# Altium project tourelles.PrjPcb
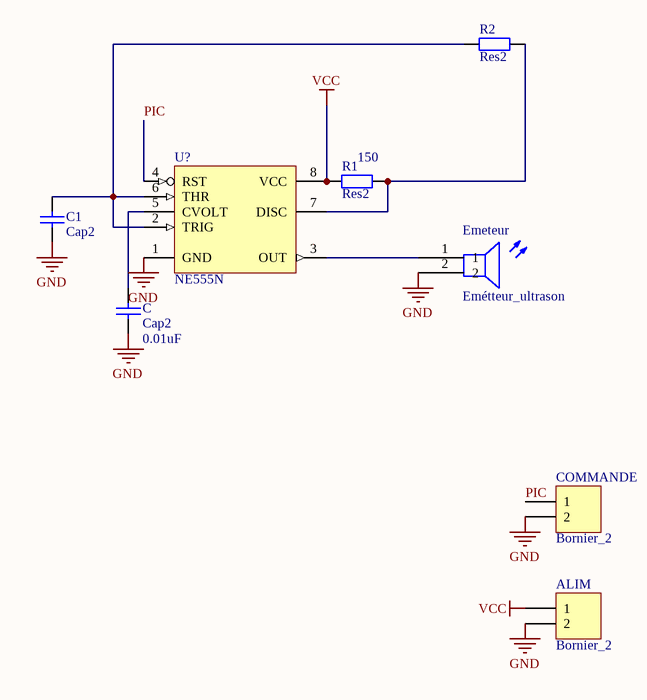
[diagram p0: tourellesEmetteurs.SchDoc]
2 sheets, 17 parts. Net scope: global (net labels, ports and power ports of the same name join across sheets).
Sheets:
  tourellesEmetteurs.SchDoc
  tourellesCommande.SchDoc

## Sheet tourellesEmetteurs.SchDoc: Tourelle
size A4

### Parts
(Parts that share a designator on the sheet are numbered #1, #2 ... from top to bottom, then left to right.)
ALIM#1  Bornier_2  [Bornier_2]
C  Cap2  value 0.01uF  [CAPA2]
C1#1  Cap2  [CAPA2]
COMMANDE  Bornier_2  [Bornier_2]
Emeteur  Emétteur_ultrason  [TX/RX_ultrason]
R1#1  Res2  value 150  [res5_1/4W]
R2  Res2  [res5_1/4W]
U?#1  NE555N  [DIP8]

### Nets
GND: ALIM#1.2 C.1 C1#1.1 COMMANDE.2 Emeteur.2 U?#1.1(GND)
VCC: ALIM#1.1 R1#1.2 U?#1.8(VCC)
PIC: COMMANDE.1 U?#1.4(RST)
NetC1#1_2: C1#1.2 R2.1 U?#1.2(TRIG) U?#1.6(THR)
NetC_2: C.2 U?#1.5(CVOLT)
NetEmeteur_1: Emeteur.1 U?#1.3(OUT)
NetR1#1_1: R1#1.1 R2.2 U?#1.7(DISC)

### Notes on the sheet
- Title :
- Size:
- A4
- Date:
- Time:
- File:

### Library data of the parts
ALIM#1 COMMANDE = Bornier_2: Header, 2-Pin; LatestRevisionDate: 17-Jul-2002; LatestRevisionNote: Re-released for DXP Platform.; Publisher: Altium Limited
C C1#1 = Cap2: Capacitor; Published: 8-Jun-2000; LatestRevisionDate: 17-Jul-2002; LatestRevisionNote: Re-released for DXP Platform.; PackageReference: RAD-0.3; Publisher: Altium Limited
Emeteur = Emétteur_ultrason: RX_ultrason; Published: 24-Mar-1999; LatestRevisionDate: 17-Jul-2002; LatestRevisionNote: Re-released for DXP Platform.; PackageReference: PIN2; Publisher: Altium Limited
R1#1 = Res2: Resistor; Published: 8-Jun-2000; LatestRevisionDate: 17-Jul-2002; LatestRevisionNote: Re-released for DXP Platform.; PackageReference: AXIAL-0.4; Publisher: Altium Limited
R2 = Res2: Resistor; Value: 1K; Published: 8-Jun-2000; LatestRevisionDate: 17-Jul-2002; LatestRevisionNote: Re-released for DXP Platform.; PackageReference: AXIAL-0.4; Publisher: Altium Limited
U?#1 = NE555N: General-Purpose Single Bipolar Timer; Published: 24-Aug-2001; LatestRevisionDate: 06-Jun-2005; LatestRevisionNote: Stylized 3D Model Added.; DatasheetVersion: Jul-1998; PackageReference: DIP8; Publisher: Altium Limited; PackageDescription: DIP; 8 Leads; Row Spacing 7.62 mm; Pitch 2.54 mm; Code_JEDEC: MO-001-AN; ComponentLink1Description: Manufacturer Link; ComponentLink1URL: http://www.st.com/; ComponentLink2Description: Datasheet; ComponentLink2URL: http://www.st.com/stonline/products/literature/ds/2182/ne555.pdf

## Sheet tourellesCommande.SchDoc: Commande
size A4
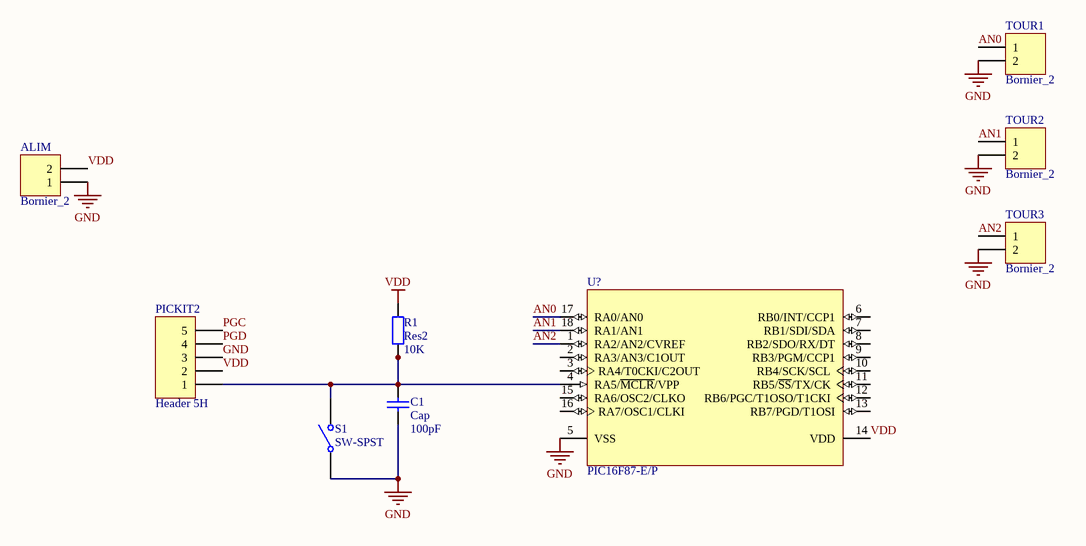
[diagram p1: tourellesCommande.SchDoc]

### Parts
(Parts that share a designator on the sheet are numbered #1, #2 ... from top to bottom, then left to right.)
ALIM#2  Bornier_2  [Bornier_2]
C1#2  Cap  value 100pF  [RAD-0.3]
PICKIT2  Header 5H  [HDR1X5]
R1#2  Res2  value 10K  [AXIAL-0.4]
S1  SW-SPST  [SPST-2]
TOUR1  Bornier_2  [Bornier_2]
TOUR2  Bornier_2  [Bornier_2]
TOUR3  Bornier_2  [Bornier_2]
U?#2  PIC16F87-E/P  [PDIP300-18]

### Nets
GND: ALIM#2.1 C1#2.1 PICKIT2.3 S1.1(COMMON) TOUR1.2 TOUR2.2 TOUR3.2 U?#2.5(VSS)
VDD: ALIM#2.2 PICKIT2.2 R1#2.2 U?#2.14(VDD)
AN0: TOUR1.1 U?#2.17(RA0/AN0)
AN1: TOUR2.1 U?#2.18(RA1/AN1)
AN2: TOUR3.1 U?#2.1(RA2/AN2/CVREF)
PGC: PICKIT2.5
PGD: PICKIT2.4
NetC1#2_2: C1#2.2 PICKIT2.1 R1#2.1 S1.2(NO) U?#2.4(RA5/~{MCLR}/VPP)

Not connected (* = marked no-connect by the designer): U?#2 2(RA3/AN3/C1OUT) 3(RA4/T0CKI/C2OUT) 6(RB0/INT/CCP1) 7(RB1/SDI/SDA) 8(RB2/SDO/RX/DT) 9(RB3/PGM/CCP1) 10(RB4/SCK/SCL) 11(RB5/~{SS}/TX/CK) 12(RB6/PGC/T1OSO/T1CKI) 13(RB7/PGD/T1OSI) 15(RA6/OSC2/CLKO) 16(RA7/OSC1/CLKI)

### Notes on the sheet
- Title :
- Size:
- A4
- Date:
- Time:
- File:

### Library data of the parts
ALIM#2 TOUR1-TOUR3 = Bornier_2: Header, 2-Pin; LatestRevisionDate: 17-Jul-2002; LatestRevisionNote: Re-released for DXP Platform.; Publisher: Altium Limited
C1#2 = Cap: Capacitor; Published: 8-Jun-2000; LatestRevisionDate: 17-Jul-2002; LatestRevisionNote: Re-released for DXP Platform.; PackageReference: RAD-0.3; Publisher: Altium Limited; PackageDescription: Radial Cap, Thru-Hole; 2 Leads; 0.3 in Pin Spacing
PICKIT2 = Header 5H: Header, 5-Pin, Right Angle; LatestRevisionDate: 17-Jul-2002; LatestRevisionNote: Re-released for DXP Platform.; Publisher: Altium Limited
R1#2 = Res2: Resistor; Published: 8-Jun-2000; LatestRevisionDate: 17-Jul-2002; LatestRevisionNote: Re-released for DXP Platform.; PackageReference: AXIAL-0.4; Publisher: Altium Limited; PackageDescription: Axial Device, Thru-Hole; 2 Leads; 0.4 in Pin Spacing
S1 = SW-SPST: Single-Pole, Single-Throw Switch; Published: 24-Mar-1999; LatestRevisionDate: 17-Jul-2002; LatestRevisionNote: Re-released for DXP Platform.; PackageReference: SPST-2; Publisher: Altium Limited; PackageDescription: Switch; 2 Leads
U?#2 = PIC16F87-E/P: Enhanced FLASH Microcontroller with nanoWatt Technology, 4K (x14-Bit words) FLASH, 368 Bytes RAM, 18-Pin PDIP, Standard VDD Range, Extended Temperature; PackageDocument: 2003; Note: 25mA source/sink per I/O.; Note: The CCP1 pin is determined by CCPMX in Configuration Word 1 register.; Published: 11-Oct-2004; LatestRevisionDate: 4-Mar-2005; LatestRevisionNote: Stylized 3D Model Added.; DatasheetDocument: DS30487B_2003; PackageReference: PDIP300-18; Publisher: Altium Limited; Code_JEDEC: MS-001; ComponentLink1Description: Manufacturer Link; ComponentLink1URL: http://www.microchip.com/index.asp; ComponentLink2Description: Datasheet; ComponentLink2URL: http://ww1.microchip.com/downloads/en/DeviceDoc/30487b.pdf; ComponentLink3Description: Packaging Specification; ComponentLink3URL: http://ww1.microchip.com/downloads/en/PackagingSpec/00049AD.pdf

## Nets that join several sheets
GND: tourellesEmetteurs (6 pins), tourellesCommande (8 pins)